# Altium schematic sheet 11.SchDoc
size 297 x 209 mm
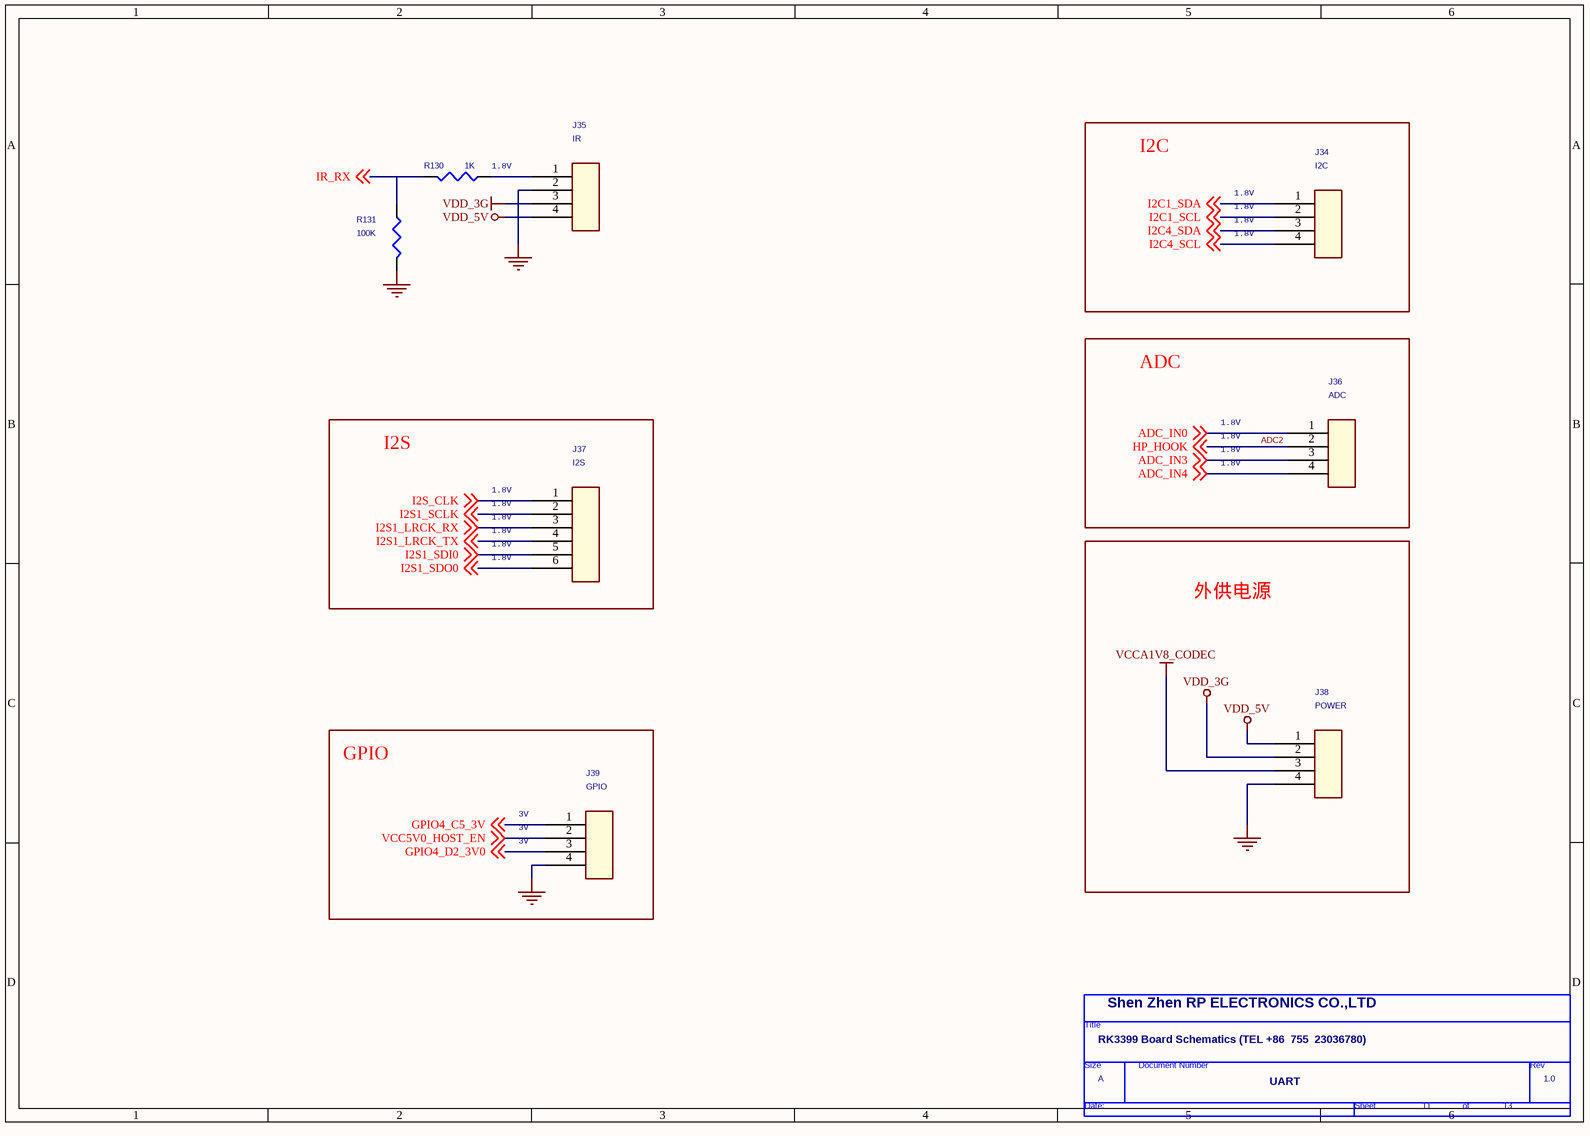
[diagram p0: 11.SchDoc]

## Parts
*  Doc: UART  RevCode: 1.0  Title: RK3399 Board Schematics (TEL +86  755  23036780)  Page Size: A  Page Number: 11  Page Count: 13  Cage Code: Shen Zhen RP ELECTRONICS CO.,LTD  (hidden comment: TitleBlock0)  (graphical)
J34  I2C  [SIP-4P-2D0]
J35  IR  [sip-4p-2d0]
J36  ADC  [SIP-4P-2D0]
J37  I2S  [SIP-6P-2D0]
J38  POWER  [SIP-4P-2D0]
J39  GPIO  [SIP-4P-2D0]
R130  1K  [0402_CC]
R131  100K  [0402_CC]

## Blocks framed on the sheet
I2C: J34
ADC: J36
I2S: J37
外供电源: J38
GPIO: J39

## Nets
GND: J35.2 J38.4 J39.4 R131.1
VCCA1V8_CODEC: J38.3
VDD_3G: J35.3 J38.2
VDD_5V: J35.4 J38.1
ADC2: J36.2 ; off-sheet HP_HOOK  [also labelled HP_HOOK]
ADC_IN0: J36.1 ; off-sheet ADC_IN0
ADC_IN3: J36.3 ; off-sheet ADC_IN3
ADC_IN4: J36.4 ; off-sheet ADC_IN4
GPIO4_C5_3V: J39.1 ; off-sheet GPIO4_C5_3V
GPIO4_D2_3V0: J39.3 ; off-sheet GPIO4_D2_3V0
I2C1_SCL: J34.2 ; off-sheet I2C1_SCL
I2C1_SDA: J34.1 ; off-sheet I2C1_SDA
I2C4_SCL: J34.4 ; off-sheet I2C4_SCL
I2C4_SDA: J34.3 ; off-sheet I2C4_SDA
I2S1_LRCK_RX: J37.3 ; off-sheet I2S1_LRCK_RX
I2S1_LRCK_TX: J37.4 ; off-sheet I2S1_LRCK_TX
I2S1_SCLK: J37.2 ; off-sheet I2S1_SCLK
I2S1_SDI0: J37.5 ; off-sheet I2S1_SDI0
I2S1_SDO0: J37.6 ; off-sheet I2S1_SDO0
I2S_CLK: J37.1 ; off-sheet I2S_CLK
IR_RX: R130.1 R131.2 ; off-sheet IR_RX
VCC5V0_HOST_EN: J39.2 ; off-sheet VCC5V0_HOST_EN
NetJ35_1: J35.1 R130.2

## Notes on the sheet
- (near R130) 1.8V
- 1.8V
- 3V
- (in symbol TitleBlock0) Title; Size; Document Number; Rev; Date:; Sheet; of

## Library data of the parts
J34-J36 J38 J39 = CON4
J37 = CON6
R130 R131 = R_Dup1
* = TitleBlock0: Page Create Date: March  8, 1995